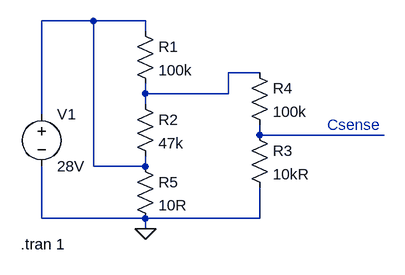
[diagram p0: schematic Conti_sensing.asc]
Conti_sensing.asc, the LTspice schematic file:
Version 4
SHEET 1 880 680
WIRE 64 48 -16 48
WIRE 144 48 64 48
WIRE 144 64 144 48
WIRE 320 128 272 128
WIRE 144 160 144 144
WIRE 272 160 272 128
WIRE 272 160 144 160
WIRE 144 176 144 160
WIRE -16 192 -16 48
WIRE 320 224 320 208
WIRE 512 224 320 224
WIRE 64 272 64 48
WIRE 144 272 144 256
WIRE 144 272 64 272
WIRE -16 352 -16 272
WIRE 144 352 -16 352
WIRE 320 352 320 304
WIRE 320 352 144 352
WIRE 144 368 144 352
FLAG 144 368 0
SYMBOL res 128 48 R0
SYMATTR InstName R1
SYMATTR Value 100k
SYMBOL res 128 160 R0
SYMATTR InstName R2
SYMATTR Value 47k
SYMBOL res 304 208 R0
SYMATTR InstName R3
SYMATTR Value 10kR
SYMBOL res 304 112 R0
SYMATTR InstName R4
SYMATTR Value 100k
SYMBOL voltage -16 176 R0
WINDOW 123 0 0 Left 0
WINDOW 39 0 0 Left 0
SYMATTR InstName V1
SYMATTR Value 28V
SYMBOL res 128 256 R0
SYMATTR InstName R5
SYMATTR Value 10R
TEXT -48 392 Left 2 !.tran 1
TEXT 424 208 Left 2 ;Csense

The netlist it stands for:
* Conti_sensing.asc
R1 N001 N002 100k
R2 N002 N001 47k
R3 N003 0 10kR
R4 N002 N003 100k
V1 N001 0 28V
R5 N001 0 10R
.tran 1
* Csense
.backanno
.end